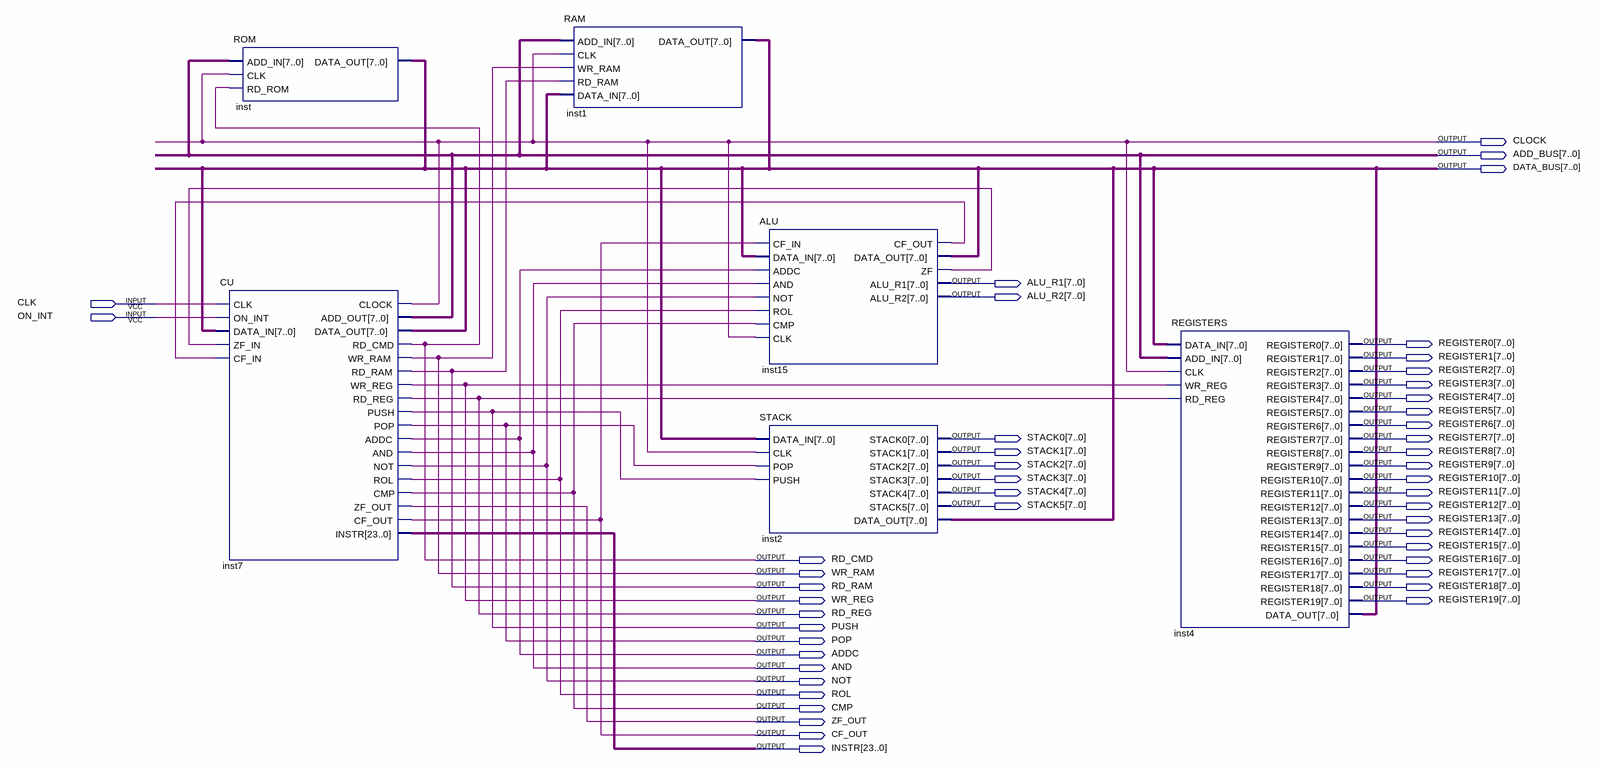
[diagram p0: schematic sheet]
// Quartus schematic CPU.bdf as structural Verilog: 6 symbols, 48 pins
module CPU (
  input  CLK,
  input  ON_INT,
  output CLOCK,
  output [7:0] ADD_BUS,
  output [7:0] DATA_BUS,
  output [7:0] ALU_R1,
  output [7:0] ALU_R2,
  output [7:0] REGISTER0,
  output [7:0] REGISTER1,
  output [7:0] REGISTER2,
  output [7:0] REGISTER3,
  output [7:0] REGISTER4,
  output [7:0] REGISTER5,
  output [7:0] REGISTER6,
  output [7:0] STACK0,
  output [7:0] REGISTER7,
  output [7:0] STACK1,
  output [7:0] REGISTER8,
  output [7:0] STACK2,
  output [7:0] REGISTER9,
  output [7:0] STACK3,
  output [7:0] REGISTER10,
  output [7:0] STACK4,
  output [7:0] REGISTER11,
  output [7:0] STACK5,
  output [7:0] REGISTER12,
  output [7:0] REGISTER13,
  output [7:0] REGISTER14,
  output [7:0] REGISTER15,
  output RD_CMD,
  output [7:0] REGISTER16,
  output WR_RAM,
  output [7:0] REGISTER17,
  output RD_RAM,
  output [7:0] REGISTER18,
  output WR_REG,
  output [7:0] REGISTER19,
  output RD_REG,
  output PUSH,
  output POP,
  output ADDC,
  output AND,
  output NOT,
  output ROL,
  output CMP,
  output ZF_OUT,
  output CF_OUT,
  output [23:0] INSTR
);

  wire inst15_cf_out, inst15_zf;

  CU inst7 (
    .CLK(CLK), .ON_INT(ON_INT), .DATA_IN(DATA_BUS), .ZF_IN(inst15_zf), .CF_IN(inst15_cf_out), .CLOCK(CLOCK),
    .ADD_OUT(ADD_BUS), .DATA_OUT(DATA_BUS), .RD_CMD(RD_CMD), .WR_RAM(WR_RAM), .RD_RAM(RD_RAM),
    .WR_REG(WR_REG), .RD_REG(RD_REG), .PUSH(PUSH), .POP(POP), .ADDC(ADDC), .AND(AND), .NOT(NOT), .ROL(ROL),
    .CMP(CMP), .ZF_OUT(ZF_OUT), .CF_OUT(CF_OUT), .INSTR(INSTR));
  ROM inst (.ADD_IN(ADD_BUS), .CLK(CLOCK), .RD_ROM(RD_CMD), .DATA_OUT(DATA_BUS));
  RAM inst1 (.ADD_IN(ADD_BUS), .CLK(CLOCK), .WR_RAM(WR_RAM), .RD_RAM(RD_RAM), .DATA_IN(DATA_BUS), .DATA_OUT(DATA_BUS));
  ALU inst15 (
    .CF_IN(CF_OUT), .DATA_IN(DATA_BUS), .ADDC(ADDC), .AND(AND), .NOT(NOT), .ROL(ROL), .CMP(CMP), .CLK(CLOCK),
    .CF_OUT(inst15_cf_out), .DATA_OUT(DATA_BUS), .ZF(inst15_zf), .ALU_R1(ALU_R1), .ALU_R2(ALU_R2));
  STACK inst2 (
    .DATA_IN(DATA_BUS), .CLK(CLOCK), .POP(POP), .PUSH(PUSH), .STACK0(STACK0), .STACK1(STACK1),
    .STACK2(STACK2), .STACK3(STACK3), .STACK4(STACK4), .STACK5(STACK5), .DATA_OUT(DATA_BUS));
  REGISTERS inst4 (
    .DATA_IN(DATA_BUS), .ADD_IN(ADD_BUS), .CLK(CLOCK), .WR_REG(WR_REG), .RD_REG(RD_REG),
    .REGISTER0(REGISTER0), .REGISTER1(REGISTER1), .REGISTER2(REGISTER2), .REGISTER3(REGISTER3),
    .REGISTER4(REGISTER4), .REGISTER5(REGISTER5), .REGISTER6(REGISTER6), .REGISTER7(REGISTER7),
    .REGISTER8(REGISTER8), .REGISTER9(REGISTER9), .REGISTER10(REGISTER10), .REGISTER11(REGISTER11),
    .REGISTER12(REGISTER12), .REGISTER13(REGISTER13), .REGISTER14(REGISTER14), .REGISTER15(REGISTER15),
    .REGISTER16(REGISTER16), .REGISTER17(REGISTER17), .REGISTER18(REGISTER18), .REGISTER19(REGISTER19),
    .DATA_OUT(DATA_BUS));
endmodule
